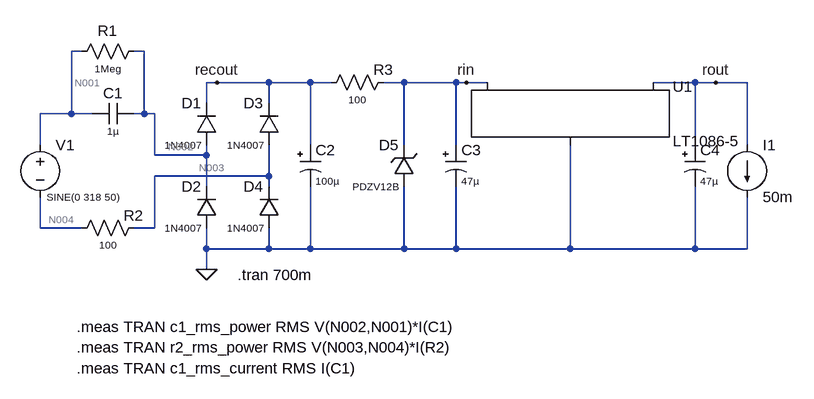
[diagram p0: schematic 01-220Vac-5Vdc.asc]
01-220Vac-5Vdc.asc, the LTspice schematic file:
Version 4
SHEET 1 1376 680
WIRE 160 -48 144 -48
WIRE 256 -48 240 -48
WIRE 368 0 352 0
WIRE 448 0 368 0
WIRE 512 0 448 0
WIRE 544 0 512 0
WIRE 656 0 624 0
WIRE 736 0 656 0
WIRE 752 0 736 0
WIRE 784 0 752 0
WIRE 1104 0 1040 0
WIRE 1136 0 1104 0
WIRE 1184 0 1136 0
WIRE 352 32 352 0
WIRE 448 32 448 0
WIRE 144 48 144 -48
WIRE 144 48 96 48
WIRE 176 48 144 48
WIRE 256 48 256 -48
WIRE 256 48 240 48
WIRE 272 48 256 48
WIRE 96 96 96 48
WIRE 512 96 512 0
WIRE 656 96 656 0
WIRE 736 96 736 0
WIRE 1104 96 1104 0
WIRE 1184 96 1184 0
WIRE 272 112 272 48
WIRE 352 112 352 96
WIRE 352 112 272 112
WIRE 448 144 448 96
WIRE 448 144 272 144
WIRE 352 160 352 112
WIRE 448 160 448 144
WIRE 96 224 96 176
WIRE 160 224 96 224
WIRE 272 224 272 144
WIRE 272 224 240 224
WIRE 352 256 352 224
WIRE 448 256 448 224
WIRE 448 256 352 256
WIRE 512 256 512 160
WIRE 512 256 448 256
WIRE 656 256 656 160
WIRE 656 256 512 256
WIRE 736 256 736 160
WIRE 736 256 656 256
WIRE 912 256 912 96
WIRE 912 256 736 256
WIRE 1104 256 1104 160
WIRE 1104 256 912 256
WIRE 1184 256 1184 176
WIRE 1184 256 1104 256
WIRE 352 288 352 256
FLAG 352 288 0
FLAG 752 0 rin
FLAG 1136 0 rout
FLAG 368 0 recout
SYMBOL voltage 96 80 R0
WINDOW 3 10 96 Left 1
WINDOW 123 0 0 Left 0
WINDOW 39 0 0 Left 0
SYMATTR Value SINE(0 318 50)
SYMATTR InstName V1
SYMBOL cap 240 32 R90
WINDOW 0 0 32 VBottom 2
WINDOW 3 32 32 VTop 1
SYMATTR InstName C1
SYMATTR Value 1µ
SYMATTR SpiceLine V=400 Irms=0 Rser=0.0253 Lser=10.46n mfg="Würth Elektronik" pn="890283326009CS WCAP-FTBP 22.5 x 26 x 17 x 8.5" type="Box"
SYMBOL res 256 -64 R90
WINDOW 0 0 56 VBottom 2
WINDOW 3 32 56 VTop 1
SYMATTR InstName R1
SYMATTR Value 1Meg
SYMATTR SpiceLine pwr=0.25
SYMBOL res 256 208 R90
WINDOW 0 12 16 VBottom 2
WINDOW 3 32 56 VTop 1
SYMATTR InstName R2
SYMATTR Value 100
SYMATTR SpiceLine pwr=3
SYMBOL diode 368 96 R180
WINDOW 0 24 64 Left 2
WINDOW 3 24 0 Left 1
SYMATTR InstName D1
SYMATTR Value 1N4007
SYMBOL diode 368 224 R180
WINDOW 0 24 64 Left 2
WINDOW 3 24 0 Left 1
SYMATTR InstName D2
SYMATTR Value 1N4007
SYMBOL diode 464 96 R180
WINDOW 0 24 64 Left 2
WINDOW 3 24 0 Left 1
SYMATTR InstName D3
SYMATTR Value 1N4007
SYMBOL diode 464 224 R180
WINDOW 0 24 64 Left 2
WINDOW 3 24 0 Left 1
SYMATTR InstName D4
SYMATTR Value 1N4007
SYMBOL polcap 496 96 R0
WINDOW 3 24 56 Left 1
SYMATTR Value 100µ
SYMATTR InstName C2
SYMATTR Description Capacitor
SYMATTR Type cap
SYMATTR SpiceLine V=50 Irms=160m Rser=0.189 Lser=5.729n mfg="Würth Elektronik" pn="865230657013 WCAP-AS5H 10x10,5" type="Al electrolytic"
SYMBOL res 640 -16 R90
WINDOW 0 12 16 VBottom 2
WINDOW 3 32 56 VTop 1
SYMATTR InstName R3
SYMATTR Value 100
SYMATTR SpiceLine pwr=3
SYMBOL PowerProducts\\LT1086-5 912 0 R0
SYMATTR InstName U1
SYMBOL polcap 720 96 R0
WINDOW 3 24 56 Left 1
SYMATTR Value 47µ
SYMATTR InstName C3
SYMATTR Description Capacitor
SYMATTR Type cap
SYMATTR SpiceLine V=50 Irms=100m Rser=0.165 Lser=900p mfg="Würth Elektronik" pn="865250657012 WCAP-ASNP 10x10,5" type="Al electrolytic"
SYMBOL polcap 1088 96 R0
WINDOW 3 24 56 Left 1
SYMATTR Value 47µ
SYMATTR InstName C4
SYMATTR Description Capacitor
SYMATTR Type cap
SYMATTR SpiceLine V=50 Irms=100m Rser=0.165 Lser=900p mfg="Würth Elektronik" pn="865250657012 WCAP-ASNP 10x10,5" type="Al electrolytic"
SYMBOL current 1184 96 R0
WINDOW 123 0 0 Left 0
WINDOW 39 0 0 Left 0
SYMATTR InstName I1
SYMATTR Value 50m
SYMBOL zener 672 160 R180
WINDOW 0 24 64 Left 2
WINDOW 3 24 0 Left 1
SYMATTR InstName D5
SYMATTR Value PDZV12B
TEXT 400 296 Left 2 !.tran 700m
TEXT 152 376 Left 2 !.meas TRAN c1_rms_power RMS V(N002,N001)*I(C1)
TEXT 152 408 Left 2 !.meas TRAN r2_rms_power RMS V(N003,N004)*I(R2)
TEXT 152 440 Left 2 !.meas TRAN c1_rms_current RMS I(C1)

The netlist it stands for:
* 01-220Vac-5Vdc.asc
V1 N001 N004 SINE(0 318 50)
C1 N002 N001 1µ V=400 Irms=0 Rser=0.0253 Lser=10.46n mfg="Würth Elektronik" pn="890283326009CS WCAP-FTBP 22.5 x 26 x 17 x 8.5" type="Box"
R1 N002 N001 1Meg pwr=0.25
R2 N003 N004 100 pwr=3
D1 N002 recout 1N4007
D2 0 N002 1N4007
D3 N003 recout 1N4007
D4 0 N003 1N4007
C2 recout 0 100µ V=50 Irms=160m Rser=0.189 Lser=5.729n mfg="Würth Elektronik" pn="865230657013 WCAP-AS5H 10x10,5" type="Al electrolytic"
R3 rin recout 100 pwr=3
XU1 0 rout rin LT1086-5
C3 rin 0 47µ V=50 Irms=100m Rser=0.165 Lser=900p mfg="Würth Elektronik" pn="865250657012 WCAP-ASNP 10x10,5" type="Al electrolytic"
C4 rout 0 47µ V=50 Irms=100m Rser=0.165 Lser=900p mfg="Würth Elektronik" pn="865250657012 WCAP-ASNP 10x10,5" type="Al electrolytic"
I1 rout 0 50m
D5 0 rin PDZV12B
.model D D
.lib standard.dio
.tran 700m
.meas TRAN c1_rms_power RMS V(N002,N001)*I(C1)
.meas TRAN r2_rms_power RMS V(N003,N004)*I(R2)
.meas TRAN c1_rms_current RMS I(C1)
.backanno
.end

* Results of the author's LTspice run, read from the files saved beside the schematic
* Operating Point, zero values left out:
*   V(n001) = -401.5 mV
*   V(n004) = -401.5 mV
*   V(n002) = -401.5 mV
*   V(n003) = -401.5 mV
*   V(recout) = -803 mV
*   V(rin) = -804.2 mV
*   V(rout) = -1.757 V
*   I(D1) = 5.887 µA
*   I(D2) = 5.887 µA
*   I(D3) = 5.887 µA
*   I(D4) = 5.887 µA
*   I(D5) = 48.17 mA
*   I(I1) = 50 mA
*   I(R3) = -11.77 µA
*   Ix(u1:1) = 1.817 mA
*   Ix(u1:2) = -50 mA
*   Ix(u1:3) = 48.18 mA
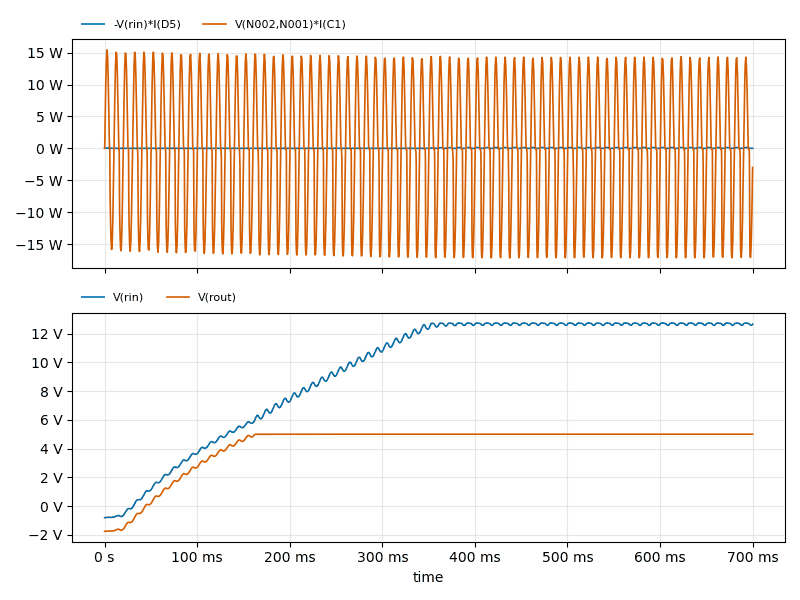
[diagram p1: Transient Analysis of 01-220Vac-5Vdc.asc, plotted from the saved traces]
* Transient Analysis, 1 run:
*   -V(rin)*I(D5): min -21.02 µW, max 138.9 mW, average 27.21 mW, rms 53.95 mW, last 625.6 µW
*   V(N002,N001)*I(C1): min -17.19 W, max 15.43 W, average -42.89 mW, rms 10.68 W, last -2.997 W
*   V(rin): min -804.2 mV, max 12.73 V, average 9.478 V, rms 10.38 V, last 12.65 V
*   V(rout): min -1.757 V, max 5.003 V, average 4.235 V, rms 4.582 V, last 5.003 V
* From the log:
*   c1_rms_power: RMS(v(n002,n001)*i(c1))=10.6405 FROM 0 TO 0.7
*   r2_rms_power: RMS(v(n003,n004)*i(r2))=0.599133 FROM 0 TO 0.7
*   c1_rms_current: RMS(i(c1))=0.0689992 FROM 0 TO 0.7